# Altium project ESE516_Whiskeypedia_A5.PrjPcb (part 2 of 2)

## Sheet I2CTemprature.SchDoc
size A4
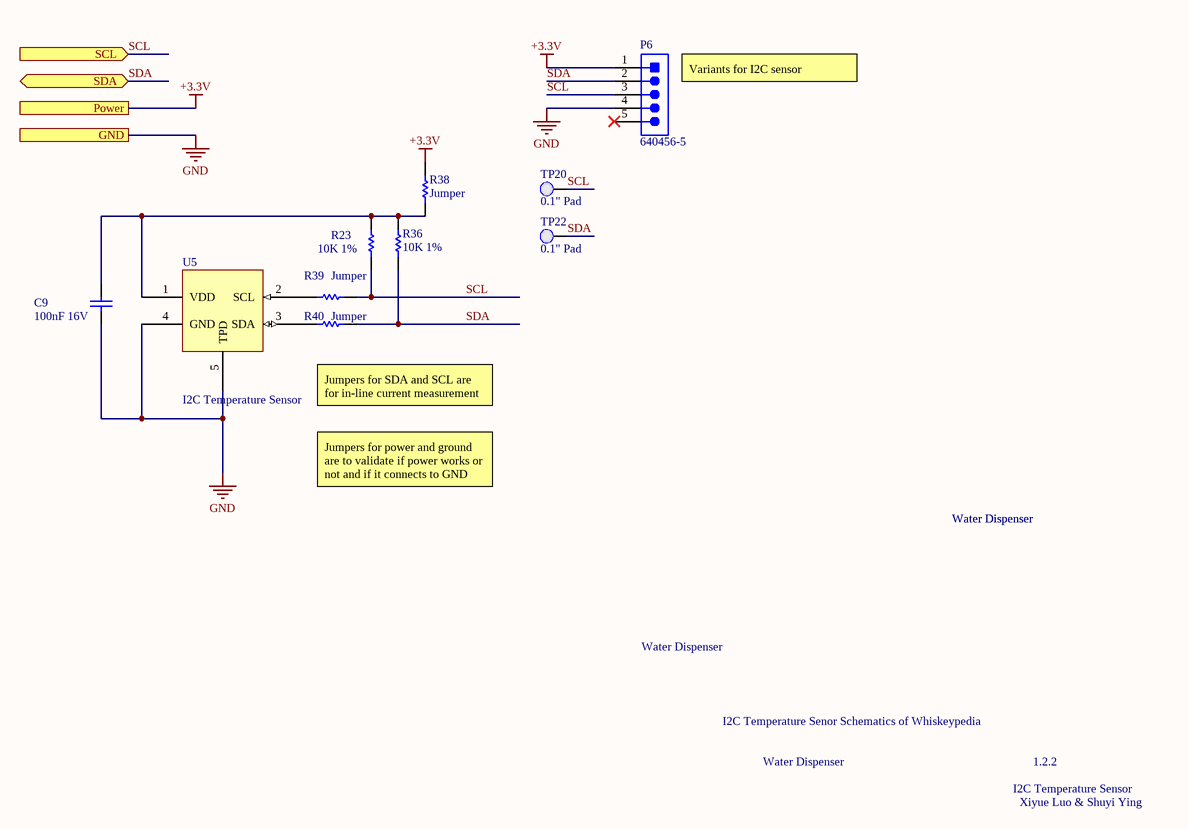
[diagram p6: I2CTemprature.SchDoc]

### Parts
C9  100nF 16V  [CAPC0603(1608)100_N]
P6  640456-5  [TECO-640456-5]
R23  10K 1%  [RESC0603(1608)_N]
R36  10K 1%  [RESC0603(1608)_N]
R38  Jumper  [RESC0805(2012)_N]
R39  Jumper  [RESC0805(2012)_N]
R40  Jumper  [RESC0805(2012)_N]
TP20  0.1" Pad  [PCBComponent]  (no BOM)
TP22  0.1" Pad  [PCBComponent]  (no BOM)
U5  I2C Temperature Sensor  [SHTC3]

### Ports
GND, Power, SCL (in), SDA (bidir)

### Nets
+3.3V: P6.1(DTR) R38.2 ; port Power  [project net 3V3]
GND: C9.1 P6.4(VCC) U5.4(GND) U5.5(TPD) ; port GND
SCL: P6.3(TXO) R23.1 R39.2 TP20.1(PAD) ; port SCL  [project net I2C_SCL]
SDA: P6.2(RXI) R36.1 R40.2 TP22.1(PAD) ; port SDA  [project net I2C_SDA]
NetC9_2: C9.2 R23.2 R36.2 R38.1 U5.1(VDD)
NetR39_1: R39.1 U5.2(SCL)
NetR40_1: R40.1 U5.3(SDA)

Not connected (* = marked no-connect by the designer): P6 5(CTS)*

### Notes on the sheet
- (near P6) Variants for I2C sensor
- Jumpers for SDA and SCL are for in-line current measurement
- Jumpers for power and ground are to validate if power works or not and if it connects to GND
- Water Dispenser
- I2C Temperature Senor Schematics of Whiskeypedia
- I2C Temperature Sensor
- 1.2.2
- Xiyue Luo & Shuyi Ying

### Library data of the parts
C9 = CMP-1035-02584-1: CAP 100nF 16V ±10% 0603 (1608 Metric) Thickness 1mm SMD; Tolerance: Â±10%; Case-EIA: 0603; Case-Metric: 1608; Technology: SMT; Max Thickness: 1 mm; Value: 100nF; Rated Voltage: 16 V
P6 = CMP-1684-00014-1: Male Header, Pitch 2.54 mm, 1 x 5 Position, Height 10.03 mm, Tail Length 3.56 mm, / -55 to 105 degC, RoHS, Bulk; Manufacturer: TE Connectivity; Material, Housing: Polyester; Brand/Series: MTA-100Series; Color, Housing: White; Current, Rating: 5 / A; Temperature, Operating: -55to+105 / °C; Connector Type: MTA-100; Agency Approvals: CSA,UL; Material, Contact: CopperAlloy; Mounting Hole Size: 0.04 / "; Voltage, Rating: 250 / V; Contact Termination Area Plating: Tin; Pin Spacing: 0.1 / "; Primary Type: InterconnectSystem; Special Features: Pinstrip; Mount Angle: Vertical; Contact Centerline Spacing: 0.100 / in.; Number of Contacts: 5; Standards: RoHSCompliant,ELVCompliant,UL94V-0; Angle: Straight; Length, Terminal Post: 0.14 / in.; Manufacturer URL: http://www.te.com; Flammability Rating: UL94V-0; Mounting Type: PCMount; Termination: Solder; Package Reference: THD; Length, Overall: 0.5 / "; Contact Mating Area Plating: Tin; Length, Pin: 0.14 / "; Datasheet URL: http://sigma.octopart.com/77881742/technical_drawing/TE-Connectivity-640456-5.pdf; Package Description: Male Header, Pitch 2.54 mm, 1 x 5 Position, Height 10.03 mm, Tail Length 3.56 mm; Datasheet Version: Rev. W3; Contact Plating: Tin; Color: White; Number of Positions: 5; Type: PCBPlug; Contact Shape: Square; Number of Rows: 1; Size, Post: 0.025 / in.
R23 R36 = CMP-1012-00623-1: 10K 0.1W 1% 0603 (1608 Metric)  SMD; Value: 10000.00 Ohm; Case-EIA: 0603; Case-Metric: 1608; Power: 0.1 W; Tolerance: 1 %; Technology: SMT
R38-R40 = CMP-1013-00001-1: Jumper 0805 (2012 Metric); Case-EIA: 0805; Value: 0.00 Ohm; Tolerance: None; Case-Metric: 2012; Technology: SMT; Power: None
TP20 TP22 = 0.1" Pad-A.4
U5 = SHTC3-TR-2.5KS: Relative Humidity & Temperature Sensor, consumer focus; Manufacturer: Sensirion; Supplier 1: Digi-Key; Supplier Part Number 1: 1649-SHTC3-TR-2.5KSCT-ND; Manufacturer Part Number: SHTC3-TR-2.5KS; RoHS: No; Stock 1: 8766; Pricing 1: 1=3.66000, 5=3.39600, 10=2.82200, 25=2.35120, 50=2.09000, 100=1.98550, 500=1.67200, 1000=1.56750 (USD)

## Nets that join several sheets
3V3: MAIN (R7.1 R22.1 R22.2 TP19.1), MCU (R30.1), Memory (5 pins), Voltage Regulator (R35.2), ActuatorSensor (Buzzer.1 D2.1), I2CTemprature (P6.1 R38.2)
5V: MAIN (P1.2 TP21.1), Voltage Regulator (R32.1), ActuatorSensor (7 pins)
12V: MAIN (P1.3 TP5.1), ActuatorSensor (K1.NO)
GND: MAIN (8 pins), FTDI (13 pins), MCU (21 pins), Memory (5 pins), Voltage Regulator (10 pins), ActuatorSensor (11 pins), I2CTemprature (C9.1 P6.4 U5.4 U5.5)
VUSB: MAIN (TP1.1), FTDI (8 pins)
FLASH_MEM_SPI_SS: MCU (U4.37), Memory (R13.1 SD1.2 TP11.1)
GND_USB: MAIN (J1.5), FTDI (R27.1)
I2C_SCL: MCU (U4.39), I2CTemprature (P6.3 R23.1 R39.2 TP20.1)
I2C_SDA: MCU (U4.38), I2CTemprature (P6.2 R36.1 R40.2 TP22.1)
MCU_LED: MAIN (DS1.2), MCU (U4.16)
MCU_RX_UART_CLI: MAIN (TP4.1), FTDI (R24.2), MCU (U4.44)
MCU_TX_UART_CLI: MAIN (TP2.1), FTDI (R26.2), MCU (U4.43)
MEM_SPI_CLK: MAIN (R10.2), Memory (SD1.5 TP10.1)
MEM_SPI_MISO: MAIN (R9.2), Memory (SD1.7 TP9.1)
MEM_SPI_MOSI: MAIN (R8.2), Memory (SD1.3 TP8.1)
PA02: MCU (U4.31), ActuatorSensor (R37.1)
PA03: MCU (U4.33), ActuatorSensor (P5.1)
PA04: MCU (U4.34), ActuatorSensor (TP18.1 U6.3)
PA06: MCU (U4.36), ActuatorSensor (P5.2)
PA10: MCU (U4.40), ActuatorSensor (R33.1)
PA11: MAIN (TP23.1), MCU (U4.41), ActuatorSensor (P3.1)
PA20: MCU (U4.13), ActuatorSensor (R18.1)
PA21: MCU (U4.14), ActuatorSensor (R16.1)
PA22: MCU (U4.15), ActuatorSensor (R17.1)
PB03: MAIN (TP24.1), MCU (U4.28), ActuatorSensor (P3.2)
SERCOM1_PAD2_SPI_MISO: MAIN (R9.1), MCU (U4.8)
SERCOM1_PAD2_SPI_MOSI: MAIN (R8.1), MCU (U4.11)
SERCOM1_PAD3_SPI_SCK: MAIN (R10.1), MCU (U4.12)
USB_DATA_N: MAIN (J1.2), FTDI (C5.1 D1.3 R1.1)
USB_DATA_P: MAIN (J1.3), FTDI (C6.1 D1.2 R2.1)
VBUS_USB: MAIN (J1.1), FTDI (R25.1)

## Assembly variants
Build_Alt: not fitted FD1 FD2 FD3 P6 P? TP1 TP2 TP3 TP4 TP6 TP7 TP8 TP9 TP10 TP11 TP12 TP13 TP14 TP15 TP16